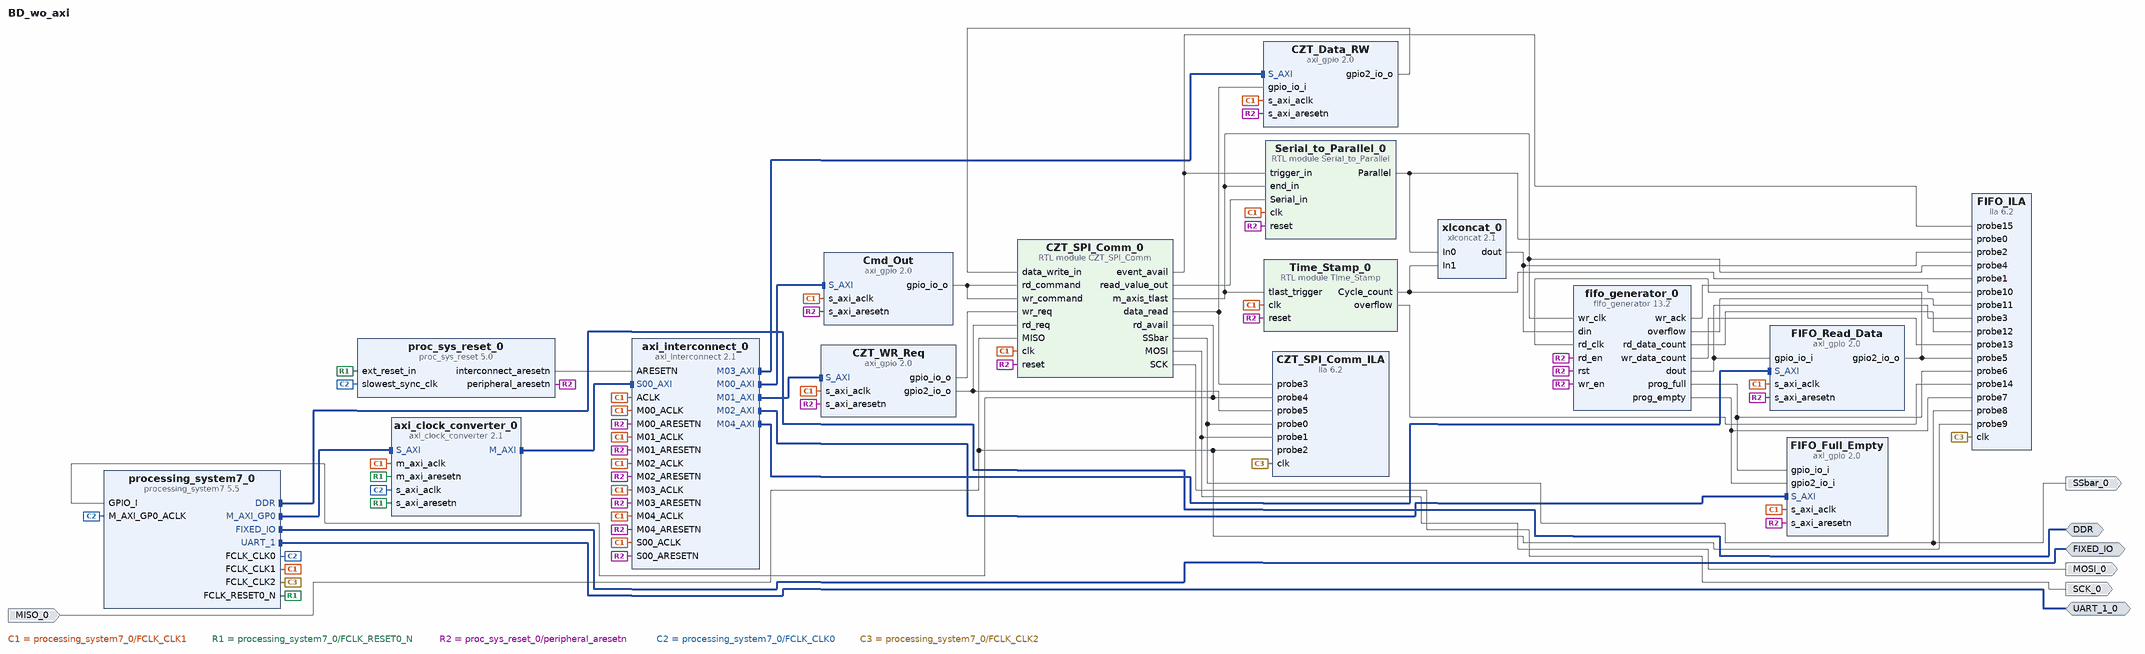
[diagram p0: block diagram of the top level]
# Vivado block design BD_wo_axi, xc7z010clg400-1, Vivado 2019.1
create_bd_design BD_wo_axi

create_bd_intf_port -mode Master -vlnv xilinx.com:interface:ddrx_rtl:1.0 DDR
create_bd_intf_port -mode Master -vlnv xilinx.com:display_processing_system7:fixedio_rtl:1.0 FIXED_IO
create_bd_intf_port -mode Master -vlnv xilinx.com:interface:uart_rtl:1.0 UART_1_0
create_bd_port -dir O SSbar_0
create_bd_port -dir O MOSI_0
create_bd_port -dir O SCK_0
create_bd_port -dir I MISO_0

create_bd_cell -type ip -vlnv xilinx.com:ip:processing_system7:5.5 processing_system7_0
set_property -dict [list \
  CONFIG.PCW_APU_PERIPHERAL_FREQMHZ 650 \
  CONFIG.PCW_CRYSTAL_PERIPHERAL_FREQMHZ 50 \
  CONFIG.PCW_EN_CLK1_PORT 1 \
  CONFIG.PCW_EN_CLK2_PORT 1 \
  CONFIG.PCW_FCLK_CLK1_BUF TRUE \
  CONFIG.PCW_FCLK_CLK2_BUF TRUE \
  CONFIG.PCW_FPGA1_PERIPHERAL_FREQMHZ 10 \
  CONFIG.PCW_FPGA2_PERIPHERAL_FREQMHZ 30 \
  CONFIG.PCW_FPGA_FCLK1_ENABLE 1 \
  CONFIG.PCW_FPGA_FCLK2_ENABLE 1 \
  CONFIG.PCW_GPIO_EMIO_GPIO_ENABLE 1 \
  CONFIG.PCW_GPIO_EMIO_GPIO_IO 1 \
  CONFIG.PCW_GPIO_EMIO_GPIO_WIDTH 1 \
  CONFIG.PCW_UART1_PERIPHERAL_ENABLE 1 \
  CONFIG.PCW_UART1_UART1_IO EMIO \
  CONFIG.PCW_UART_PERIPHERAL_FREQMHZ 100 \
  CONFIG.PCW_UIPARAM_DDR_FREQ_MHZ 525 \
] [get_bd_cells processing_system7_0]
# 35 more settings of processing_system7_0 are not shown: defaults, MIO pin electricals, DDR timing, and values the tool derives
create_bd_cell -type ip -vlnv xilinx.com:ip:axi_clock_converter:2.1 axi_clock_converter_0
create_bd_cell -type ip -vlnv xilinx.com:ip:fifo_generator:13.2 fifo_generator_0
set_property -dict [list \
  CONFIG.Almost_Empty_Flag true \
  CONFIG.Almost_Full_Flag true \
  CONFIG.Empty_Threshold_Assert_Value 1000 \
  CONFIG.Enable_Safety_Circuit false \
  CONFIG.Fifo_Implementation Independent_Clocks_Block_RAM \
  CONFIG.Full_Flags_Reset_Value 1 \
  CONFIG.Full_Threshold_Assert_Value 15000 \
  CONFIG.Input_Data_Width 64 \
  CONFIG.Input_Depth 16384 \
  CONFIG.Output_Data_Width 32 \
  CONFIG.Overflow_Flag true \
  CONFIG.Programmable_Empty_Type Single_Programmable_Empty_Threshold_Constant \
  CONFIG.Programmable_Full_Type Single_Programmable_Full_Threshold_Constant \
  CONFIG.Read_Data_Count true \
  CONFIG.Read_Data_Count_Width 15 \
  CONFIG.Write_Acknowledge_Flag true \
  CONFIG.Write_Data_Count true \
  CONFIG.Write_Data_Count_Width 14 \
] [get_bd_cells fifo_generator_0]
create_bd_cell -type ip -vlnv xilinx.com:ip:proc_sys_reset:5.0 proc_sys_reset_0
create_bd_cell -type module -reference CZT_SPI_Comm CZT_SPI_Comm_0
create_bd_cell -type module -reference Serial_to_Parallel Serial_to_Parallel_0
create_bd_cell -type ip -vlnv xilinx.com:ip:xlconcat:2.1 xlconcat_0
set_property -dict {CONFIG.IN0_WIDTH 32 CONFIG.IN1_WIDTH 32} [get_bd_cells xlconcat_0]
create_bd_cell -type ip -vlnv xilinx.com:ip:axi_interconnect:2.1 axi_interconnect_0
set_property -dict {CONFIG.NUM_MI 5} [get_bd_cells axi_interconnect_0]
create_bd_cell -type ip -vlnv xilinx.com:ip:axi_gpio:2.0 FIFO_Full_Empty
set_property -dict [list \
  CONFIG.C_ALL_INPUTS 1 \
  CONFIG.C_ALL_INPUTS_2 1 \
  CONFIG.C_GPIO2_WIDTH 1 \
  CONFIG.C_GPIO_WIDTH 1 \
  CONFIG.C_IS_DUAL 1 \
] [get_bd_cells FIFO_Full_Empty]
create_bd_cell -type ip -vlnv xilinx.com:ip:axi_gpio:2.0 FIFO_Read_Data
set_property -dict [list \
  CONFIG.C_ALL_INPUTS 1 \
  CONFIG.C_ALL_OUTPUTS_2 1 \
  CONFIG.C_GPIO2_WIDTH 1 \
  CONFIG.C_IS_DUAL 1 \
] [get_bd_cells FIFO_Read_Data]
create_bd_cell -type ip -vlnv xilinx.com:ip:axi_gpio:2.0 Cmd_Out
set_property -dict {CONFIG.C_ALL_OUTPUTS 1 CONFIG.C_GPIO_WIDTH 10} [get_bd_cells Cmd_Out]
create_bd_cell -type ip -vlnv xilinx.com:ip:axi_gpio:2.0 CZT_WR_Req
set_property -dict [list \
  CONFIG.C_ALL_INPUTS_2 0 \
  CONFIG.C_ALL_OUTPUTS 1 \
  CONFIG.C_ALL_OUTPUTS_2 1 \
  CONFIG.C_GPIO2_WIDTH 1 \
  CONFIG.C_GPIO_WIDTH 1 \
  CONFIG.C_IS_DUAL 1 \
] [get_bd_cells CZT_WR_Req]
create_bd_cell -type ip -vlnv xilinx.com:ip:axi_gpio:2.0 CZT_Data_RW
set_property -dict [list \
  CONFIG.C_ALL_INPUTS 1 \
  CONFIG.C_ALL_INPUTS_2 0 \
  CONFIG.C_ALL_OUTPUTS_2 1 \
  CONFIG.C_GPIO2_WIDTH 32 \
  CONFIG.C_GPIO_WIDTH 32 \
  CONFIG.C_IS_DUAL 1 \
] [get_bd_cells CZT_Data_RW]
create_bd_cell -type ip -vlnv xilinx.com:ip:ila:6.2 FIFO_ILA
set_property -dict [list \
  CONFIG.C_ENABLE_ILA_AXI_MON false \
  CONFIG.C_MONITOR_TYPE Native \
  CONFIG.C_NUM_OF_PROBES 16 \
  CONFIG.C_PROBE0_WIDTH 32 \
  CONFIG.C_PROBE12_WIDTH 15 \
  CONFIG.C_PROBE13_WIDTH 14 \
  CONFIG.C_PROBE1_WIDTH 32 \
  CONFIG.C_PROBE2_WIDTH 64 \
] [get_bd_cells FIFO_ILA]
create_bd_cell -type module -reference Time_Stamp Time_Stamp_0
create_bd_cell -type ip -vlnv xilinx.com:ip:ila:6.2 CZT_SPI_Comm_ILA
set_property -dict [list \
  CONFIG.C_ENABLE_ILA_AXI_MON false \
  CONFIG.C_MONITOR_TYPE Native \
  CONFIG.C_NUM_OF_PROBES 6 \
  CONFIG.C_PROBE0_WIDTH 1 \
  CONFIG.C_PROBE3_WIDTH 32 \
] [get_bd_cells CZT_SPI_Comm_ILA]

# ---- connections ----

connect_bd_intf_net [get_bd_intf_ports DDR] [get_bd_intf_pins processing_system7_0/DDR]
connect_bd_intf_net [get_bd_intf_ports FIXED_IO] [get_bd_intf_pins processing_system7_0/FIXED_IO]
connect_bd_intf_net [get_bd_intf_ports UART_1_0] [get_bd_intf_pins processing_system7_0/UART_1]
connect_bd_intf_net [get_bd_intf_pins axi_interconnect_0/M03_AXI] [get_bd_intf_pins CZT_Data_RW/S_AXI]
connect_bd_intf_net [get_bd_intf_pins axi_interconnect_0/M02_AXI] [get_bd_intf_pins FIFO_Full_Empty/S_AXI]
connect_bd_intf_net [get_bd_intf_pins axi_interconnect_0/M01_AXI] [get_bd_intf_pins CZT_WR_Req/S_AXI]
connect_bd_intf_net [get_bd_intf_pins axi_interconnect_0/M00_AXI] [get_bd_intf_pins Cmd_Out/S_AXI]
connect_bd_intf_net [get_bd_intf_pins axi_interconnect_0/M04_AXI] [get_bd_intf_pins FIFO_Read_Data/S_AXI]
connect_bd_intf_net [get_bd_intf_pins processing_system7_0/M_AXI_GP0] [get_bd_intf_pins axi_clock_converter_0/S_AXI]
connect_bd_intf_net [get_bd_intf_pins axi_interconnect_0/S00_AXI] [get_bd_intf_pins axi_clock_converter_0/M_AXI]
connect_bd_net [get_bd_pins processing_system7_0/FCLK_CLK1] \
  [get_bd_pins Serial_to_Parallel_0/clk] [get_bd_pins CZT_SPI_Comm_0/clk] [get_bd_pins axi_clock_converter_0/m_axi_aclk] \
  [get_bd_pins axi_interconnect_0/ACLK] [get_bd_pins axi_interconnect_0/S00_ACLK] [get_bd_pins axi_interconnect_0/M00_ACLK] \
  [get_bd_pins axi_interconnect_0/M01_ACLK] [get_bd_pins axi_interconnect_0/M04_ACLK] \
  [get_bd_pins axi_interconnect_0/M03_ACLK] [get_bd_pins axi_interconnect_0/M02_ACLK] \
  [get_bd_pins FIFO_Full_Empty/s_axi_aclk] [get_bd_pins FIFO_Read_Data/s_axi_aclk] [get_bd_pins Cmd_Out/s_axi_aclk] \
  [get_bd_pins CZT_WR_Req/s_axi_aclk] [get_bd_pins CZT_Data_RW/s_axi_aclk] [get_bd_pins Time_Stamp_0/clk]
connect_bd_net [get_bd_pins Serial_to_Parallel_0/Parallel] [get_bd_pins xlconcat_0/In0] [get_bd_pins FIFO_ILA/probe0]
connect_bd_net [get_bd_pins Time_Stamp_0/Cycle_count] [get_bd_pins xlconcat_0/In1] [get_bd_pins FIFO_ILA/probe1]
connect_bd_net [get_bd_pins xlconcat_0/dout] [get_bd_pins fifo_generator_0/din] [get_bd_pins FIFO_ILA/probe2]
connect_bd_net [get_bd_pins processing_system7_0/FCLK_RESET0_N] \
  [get_bd_pins axi_clock_converter_0/m_axi_aresetn] [get_bd_pins axi_clock_converter_0/s_axi_aresetn] \
  [get_bd_pins proc_sys_reset_0/ext_reset_in]
connect_bd_net [get_bd_pins proc_sys_reset_0/interconnect_aresetn] [get_bd_pins axi_interconnect_0/ARESETN]
connect_bd_net [get_bd_pins proc_sys_reset_0/peripheral_aresetn] \
  [get_bd_pins axi_interconnect_0/S00_ARESETN] [get_bd_pins axi_interconnect_0/M00_ARESETN] \
  [get_bd_pins axi_interconnect_0/M01_ARESETN] [get_bd_pins axi_interconnect_0/M02_ARESETN] \
  [get_bd_pins axi_interconnect_0/M03_ARESETN] [get_bd_pins axi_interconnect_0/M04_ARESETN] \
  [get_bd_pins CZT_SPI_Comm_0/reset] [get_bd_pins Serial_to_Parallel_0/reset] [get_bd_pins fifo_generator_0/rd_en] \
  [get_bd_pins fifo_generator_0/wr_en] [get_bd_pins fifo_generator_0/rst] [get_bd_pins FIFO_Full_Empty/s_axi_aresetn] \
  [get_bd_pins FIFO_Read_Data/s_axi_aresetn] [get_bd_pins Cmd_Out/s_axi_aresetn] [get_bd_pins CZT_WR_Req/s_axi_aresetn] \
  [get_bd_pins CZT_Data_RW/s_axi_aresetn] [get_bd_pins Time_Stamp_0/reset]
connect_bd_net [get_bd_pins CZT_SPI_Comm_0/SSbar] [get_bd_ports SSbar_0] [get_bd_pins FIFO_ILA/probe8] [get_bd_pins CZT_SPI_Comm_ILA/probe0]
connect_bd_net [get_bd_pins CZT_SPI_Comm_0/MOSI] [get_bd_ports MOSI_0] [get_bd_pins CZT_SPI_Comm_ILA/probe1]
connect_bd_net [get_bd_pins CZT_SPI_Comm_0/SCK] [get_bd_ports SCK_0]
connect_bd_net [get_bd_ports MISO_0] [get_bd_pins CZT_SPI_Comm_0/MISO] [get_bd_pins FIFO_ILA/probe9] [get_bd_pins CZT_SPI_Comm_ILA/probe2]
connect_bd_net -net m_axis_tlast_wire [get_bd_pins CZT_SPI_Comm_0/m_axis_tlast] \
  [get_bd_pins Serial_to_Parallel_0/end_in] [get_bd_pins fifo_generator_0/wr_clk] [get_bd_pins FIFO_ILA/probe4] \
  [get_bd_pins Time_Stamp_0/tlast_trigger]
connect_bd_net [get_bd_pins fifo_generator_0/prog_full] [get_bd_pins FIFO_Full_Empty/gpio_io_i] [get_bd_pins FIFO_ILA/probe6]
connect_bd_net [get_bd_pins fifo_generator_0/prog_empty] [get_bd_pins FIFO_Full_Empty/gpio2_io_i] [get_bd_pins FIFO_ILA/probe7]
connect_bd_net [get_bd_pins fifo_generator_0/dout] [get_bd_pins FIFO_Read_Data/gpio_io_i] [get_bd_pins FIFO_ILA/probe3]
connect_bd_net [get_bd_pins FIFO_Read_Data/gpio2_io_o] [get_bd_pins fifo_generator_0/rd_clk] [get_bd_pins FIFO_ILA/probe5]
connect_bd_net [get_bd_pins CZT_SPI_Comm_0/data_read] [get_bd_pins CZT_Data_RW/gpio_io_i] [get_bd_pins CZT_SPI_Comm_ILA/probe3]
connect_bd_net [get_bd_pins CZT_SPI_Comm_0/read_value_out] [get_bd_pins Serial_to_Parallel_0/Serial_in]
connect_bd_net [get_bd_pins CZT_SPI_Comm_0/rd_avail] [get_bd_pins processing_system7_0/GPIO_I] [get_bd_pins CZT_SPI_Comm_ILA/probe4]
connect_bd_net [get_bd_pins CZT_SPI_Comm_0/event_avail] [get_bd_pins Serial_to_Parallel_0/trigger_in] [get_bd_pins FIFO_ILA/probe15]
connect_bd_net [get_bd_pins Cmd_Out/gpio_io_o] [get_bd_pins CZT_SPI_Comm_0/wr_command] [get_bd_pins CZT_SPI_Comm_0/rd_command]
connect_bd_net [get_bd_pins CZT_WR_Req/gpio_io_o] [get_bd_pins CZT_SPI_Comm_0/wr_req]
connect_bd_net [get_bd_pins CZT_WR_Req/gpio2_io_o] [get_bd_pins CZT_SPI_Comm_0/rd_req] [get_bd_pins CZT_SPI_Comm_ILA/probe5]
connect_bd_net [get_bd_pins CZT_Data_RW/gpio2_io_o] [get_bd_pins CZT_SPI_Comm_0/data_write_in]
connect_bd_net [get_bd_pins fifo_generator_0/wr_ack] [get_bd_pins FIFO_ILA/probe10]
connect_bd_net [get_bd_pins fifo_generator_0/overflow] [get_bd_pins FIFO_ILA/probe11]
connect_bd_net [get_bd_pins fifo_generator_0/rd_data_count] [get_bd_pins FIFO_ILA/probe12]
connect_bd_net [get_bd_pins fifo_generator_0/wr_data_count] [get_bd_pins FIFO_ILA/probe13]
connect_bd_net [get_bd_pins Time_Stamp_0/overflow] [get_bd_pins FIFO_ILA/probe14]
connect_bd_net [get_bd_pins processing_system7_0/FCLK_CLK0] \
  [get_bd_pins proc_sys_reset_0/slowest_sync_clk] [get_bd_pins axi_clock_converter_0/s_axi_aclk] \
  [get_bd_pins processing_system7_0/M_AXI_GP0_ACLK]
connect_bd_net [get_bd_pins processing_system7_0/FCLK_CLK2] [get_bd_pins CZT_SPI_Comm_ILA/clk] [get_bd_pins FIFO_ILA/clk]

# ---- address map ----
assign_bd_address -offset 0x41200000 -range 64K -target_address_space [get_bd_addr_spaces processing_system7_0/Data] [get_bd_addr_segs CZT_Data_RW/S_AXI/Reg]
assign_bd_address -offset 0x41210000 -range 64K -target_address_space [get_bd_addr_spaces processing_system7_0/Data] [get_bd_addr_segs CZT_WR_Req/S_AXI/Reg]
assign_bd_address -offset 0x41220000 -range 64K -target_address_space [get_bd_addr_spaces processing_system7_0/Data] [get_bd_addr_segs Cmd_Out/S_AXI/Reg]
assign_bd_address -offset 0x41230000 -range 64K -target_address_space [get_bd_addr_spaces processing_system7_0/Data] [get_bd_addr_segs FIFO_Full_Empty/S_AXI/Reg]
assign_bd_address -offset 0x41240000 -range 64K -target_address_space [get_bd_addr_spaces processing_system7_0/Data] [get_bd_addr_segs FIFO_Read_Data/S_AXI/Reg]

validate_bd_design
save_bd_design
